# Altium schematic sheet Rows.SchDoc
size A4; DocumentNumber: 2; SheetNumber: 2; SheetTotal: 3
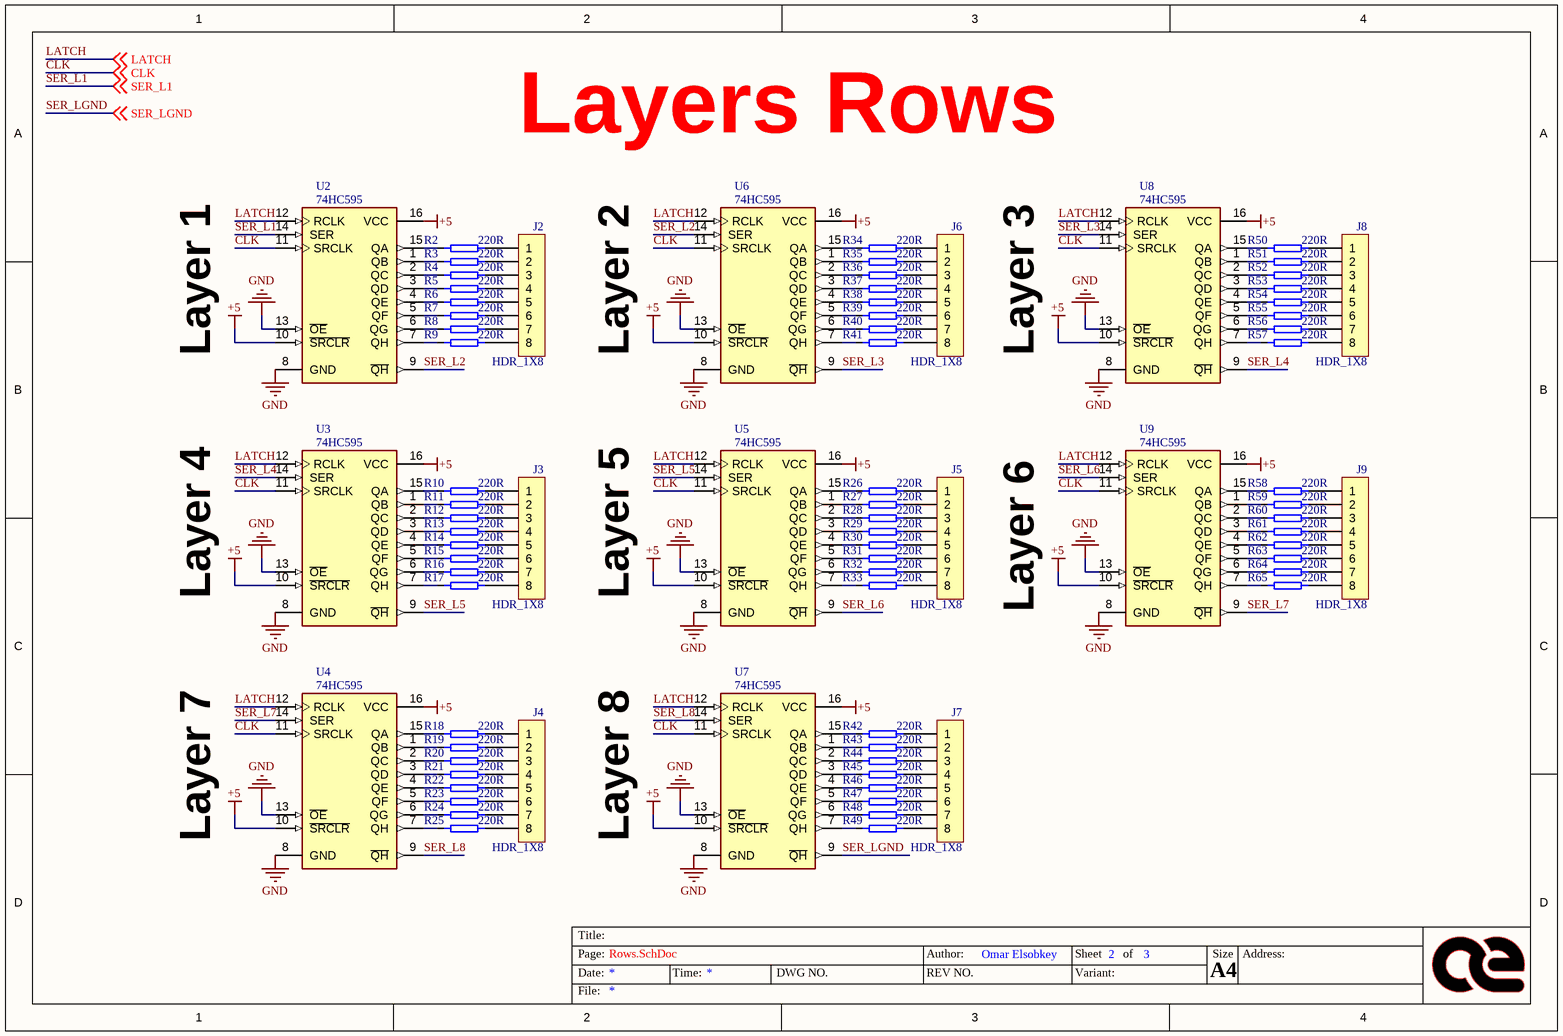
[diagram p0: Rows.SchDoc]

## Parts
J2  HDR_1X8  [HDR_1X8_2.54MM]
J3  HDR_1X8  [HDR_1X8_2.54MM]
J4  HDR_1X8  [HDR_1X8_2.54MM]
J5  HDR_1X8  [HDR_1X8_2.54MM]
J6  HDR_1X8  [HDR_1X8_2.54MM]
J7  HDR_1X8  [HDR_1X8_2.54MM]
J8  HDR_1X8  [HDR_1X8_2.54MM]
J9  HDR_1X8  [HDR_1X8_2.54MM]
R2  220R  [R_AXIAL_0.3MM]
R3  220R  [R_AXIAL_0.3MM]
R4  220R  [R_AXIAL_0.3MM]
R5  220R  [R_AXIAL_0.3MM]
R6  220R  [R_AXIAL_0.3MM]
R7  220R  [R_AXIAL_0.3MM]
R8  220R  [R_AXIAL_0.3MM]
R9  220R  [R_AXIAL_0.3MM]
R10  220R  [R_AXIAL_0.3MM]
R11  220R  [R_AXIAL_0.3MM]
R12  220R  [R_AXIAL_0.3MM]
R13  220R  [R_AXIAL_0.3MM]
R14  220R  [R_AXIAL_0.3MM]
R15  220R  [R_AXIAL_0.3MM]
R16  220R  [R_AXIAL_0.3MM]
R17  220R  [R_AXIAL_0.3MM]
R18  220R  [R_AXIAL_0.3MM]
R19  220R  [R_AXIAL_0.3MM]
R20  220R  [R_AXIAL_0.3MM]
R21  220R  [R_AXIAL_0.3MM]
R22  220R  [R_AXIAL_0.3MM]
R23  220R  [R_AXIAL_0.3MM]
R24  220R  [R_AXIAL_0.3MM]
R25  220R  [R_AXIAL_0.3MM]
R26  220R  [R_AXIAL_0.3MM]
R27  220R  [R_AXIAL_0.3MM]
R28  220R  [R_AXIAL_0.3MM]
R29  220R  [R_AXIAL_0.3MM]
R30  220R  [R_AXIAL_0.3MM]
R31  220R  [R_AXIAL_0.3MM]
R32  220R  [R_AXIAL_0.3MM]
R33  220R  [R_AXIAL_0.3MM]
R34  220R  [R_AXIAL_0.3MM]
R35  220R  [R_AXIAL_0.3MM]
R36  220R  [R_AXIAL_0.3MM]
R37  220R  [R_AXIAL_0.3MM]
R38  220R  [R_AXIAL_0.3MM]
R39  220R  [R_AXIAL_0.3MM]
R40  220R  [R_AXIAL_0.3MM]
R41  220R  [R_AXIAL_0.3MM]
R42  220R  [R_AXIAL_0.3MM]
R43  220R  [R_AXIAL_0.3MM]
R44  220R  [R_AXIAL_0.3MM]
R45  220R  [R_AXIAL_0.3MM]
R46  220R  [R_AXIAL_0.3MM]
R47  220R  [R_AXIAL_0.3MM]
R48  220R  [R_AXIAL_0.3MM]
R49  220R  [R_AXIAL_0.3MM]
R50  220R  [R_AXIAL_0.3MM]
R51  220R  [R_AXIAL_0.3MM]
R52  220R  [R_AXIAL_0.3MM]
R53  220R  [R_AXIAL_0.3MM]
R54  220R  [R_AXIAL_0.3MM]
R55  220R  [R_AXIAL_0.3MM]
R56  220R  [R_AXIAL_0.3MM]
R57  220R  [R_AXIAL_0.3MM]
R58  220R  [R_AXIAL_0.3MM]
R59  220R  [R_AXIAL_0.3MM]
R60  220R  [R_AXIAL_0.3MM]
R61  220R  [R_AXIAL_0.3MM]
R62  220R  [R_AXIAL_0.3MM]
R63  220R  [R_AXIAL_0.3MM]
R64  220R  [R_AXIAL_0.3MM]
R65  220R  [R_AXIAL_0.3MM]
U2  74HC595  [DIP16]
U3  74HC595  [DIP16]
U4  74HC595  [DIP16]
U5  74HC595  [DIP16]
U6  74HC595  [DIP16]
U7  74HC595  [DIP16]
U8  74HC595  [DIP16]
U9  74HC595  [DIP16]

## Nets
+5: U2.10(~{SRCLR}) U2.16(VCC) U3.10(~{SRCLR}) U3.16(VCC) U4.10(~{SRCLR}) U4.16(VCC) U5.10(~{SRCLR}) U5.16(VCC) U6.10(~{SRCLR}) U6.16(VCC) U7.10(~{SRCLR}) U7.16(VCC) U8.10(~{SRCLR}) U8.16(VCC) U9.10(~{SRCLR}) U9.16(VCC)
GND: U2.8(GND) U2.13(~{OE}) U3.8(GND) U3.13(~{OE}) U4.8(GND) U4.13(~{OE}) U5.8(GND) U5.13(~{OE}) U6.8(GND) U6.13(~{OE}) U7.8(GND) U7.13(~{OE}) U8.8(GND) U8.13(~{OE}) U9.8(GND) U9.13(~{OE})
CLK: U2.11(SRCLK) U3.11(SRCLK) U4.11(SRCLK) U5.11(SRCLK) U6.11(SRCLK) U7.11(SRCLK) U8.11(SRCLK) U9.11(SRCLK) ; off-sheet CLK
LATCH: U2.12(RCLK) U3.12(RCLK) U4.12(RCLK) U5.12(RCLK) U6.12(RCLK) U7.12(RCLK) U8.12(RCLK) U9.12(RCLK) ; off-sheet LATCH
SER_L1: U2.14(SER) ; off-sheet SER_L1
SER_L2: U2.9(~{QH}) U6.14(SER)
SER_L3: U6.9(~{QH}) U8.14(SER)
SER_L4: U3.14(SER) U8.9(~{QH})
SER_L5: U3.9(~{QH}) U5.14(SER)
SER_L6: U5.9(~{QH}) U9.14(SER)
SER_L7: U4.14(SER) U9.9(~{QH})
SER_L8: U4.9(~{QH}) U7.14(SER)
SER_LGND: U7.9(~{QH}) ; off-sheet SER_LGND
NetJ2_1: J2.1 R2.2
NetJ2_2: J2.2 R3.2
NetJ2_3: J2.3 R4.2
NetJ2_4: J2.4 R5.2
NetJ2_5: J2.5 R6.2
NetJ2_6: J2.6 R7.2
NetJ2_7: J2.7 R8.2
NetJ2_8: J2.8 R9.2
NetJ3_1: J3.1 R10.2
NetJ3_2: J3.2 R11.2
NetJ3_3: J3.3 R12.2
NetJ3_4: J3.4 R13.2
NetJ3_5: J3.5 R14.2
NetJ3_6: J3.6 R15.2
NetJ3_7: J3.7 R16.2
NetJ3_8: J3.8 R17.2
NetJ4_1: J4.1 R18.2
NetJ4_2: J4.2 R19.2
NetJ4_3: J4.3 R20.2
NetJ4_4: J4.4 R21.2
NetJ4_5: J4.5 R22.2
NetJ4_6: J4.6 R23.2
NetJ4_7: J4.7 R24.2
NetJ4_8: J4.8 R25.2
NetJ5_1: J5.1 R26.2
NetJ5_2: J5.2 R27.2
NetJ5_3: J5.3 R28.2
NetJ5_4: J5.4 R29.2
NetJ5_5: J5.5 R30.2
NetJ5_6: J5.6 R31.2
NetJ5_7: J5.7 R32.2
NetJ5_8: J5.8 R33.2
NetJ6_1: J6.1 R34.2
NetJ6_2: J6.2 R35.2
NetJ6_3: J6.3 R36.2
NetJ6_4: J6.4 R37.2
NetJ6_5: J6.5 R38.2
NetJ6_6: J6.6 R39.2
NetJ6_7: J6.7 R40.2
NetJ6_8: J6.8 R41.2
NetJ7_1: J7.1 R42.2
NetJ7_2: J7.2 R43.2
NetJ7_3: J7.3 R44.2
NetJ7_4: J7.4 R45.2
NetJ7_5: J7.5 R46.2
NetJ7_6: J7.6 R47.2
NetJ7_7: J7.7 R48.2
NetJ7_8: J7.8 R49.2
NetJ8_1: J8.1 R50.2
NetJ8_2: J8.2 R51.2
NetJ8_3: J8.3 R52.2
NetJ8_4: J8.4 R53.2
NetJ8_5: J8.5 R54.2
NetJ8_6: J8.6 R55.2
NetJ8_7: J8.7 R56.2
NetJ8_8: J8.8 R57.2
NetJ9_1: J9.1 R58.2
NetJ9_2: J9.2 R59.2
NetJ9_3: J9.3 R60.2
NetJ9_4: J9.4 R61.2
NetJ9_5: J9.5 R62.2
NetJ9_6: J9.6 R63.2
NetJ9_7: J9.7 R64.2
NetJ9_8: J9.8 R65.2
NetR2_1: R2.1 U2.15(QA)
NetR3_1: R3.1 U2.1(QB)
NetR4_1: R4.1 U2.2(QC)
NetR5_1: R5.1 U2.3(QD)
NetR6_1: R6.1 U2.4(QE)
NetR7_1: R7.1 U2.5(QF)
NetR8_1: R8.1 U2.6(QG)
NetR9_1: R9.1 U2.7(QH)
NetR10_1: R10.1 U3.15(QA)
NetR11_1: R11.1 U3.1(QB)
NetR12_1: R12.1 U3.2(QC)
NetR13_1: R13.1 U3.3(QD)
NetR14_1: R14.1 U3.4(QE)
NetR15_1: R15.1 U3.5(QF)
NetR16_1: R16.1 U3.6(QG)
NetR17_1: R17.1 U3.7(QH)
NetR18_1: R18.1 U4.15(QA)
NetR19_1: R19.1 U4.1(QB)
NetR20_1: R20.1 U4.2(QC)
NetR21_1: R21.1 U4.3(QD)
NetR22_1: R22.1 U4.4(QE)
NetR23_1: R23.1 U4.5(QF)
NetR24_1: R24.1 U4.6(QG)
NetR25_1: R25.1 U4.7(QH)
NetR26_1: R26.1 U5.15(QA)
NetR27_1: R27.1 U5.1(QB)
NetR28_1: R28.1 U5.2(QC)
NetR29_1: R29.1 U5.3(QD)
NetR30_1: R30.1 U5.4(QE)
NetR31_1: R31.1 U5.5(QF)
NetR32_1: R32.1 U5.6(QG)
NetR33_1: R33.1 U5.7(QH)
NetR34_1: R34.1 U6.15(QA)
NetR35_1: R35.1 U6.1(QB)
NetR36_1: R36.1 U6.2(QC)
NetR37_1: R37.1 U6.3(QD)
NetR38_1: R38.1 U6.4(QE)
NetR39_1: R39.1 U6.5(QF)
NetR40_1: R40.1 U6.6(QG)
NetR41_1: R41.1 U6.7(QH)
NetR42_1: R42.1 U7.15(QA)
NetR43_1: R43.1 U7.1(QB)
NetR44_1: R44.1 U7.2(QC)
NetR45_1: R45.1 U7.3(QD)
NetR46_1: R46.1 U7.4(QE)
NetR47_1: R47.1 U7.5(QF)
NetR48_1: R48.1 U7.6(QG)
NetR49_1: R49.1 U7.7(QH)
NetR50_1: R50.1 U8.15(QA)
NetR51_1: R51.1 U8.1(QB)
NetR52_1: R52.1 U8.2(QC)
NetR53_1: R53.1 U8.3(QD)
NetR54_1: R54.1 U8.4(QE)
NetR55_1: R55.1 U8.5(QF)
NetR56_1: R56.1 U8.6(QG)
NetR57_1: R57.1 U8.7(QH)
NetR58_1: R58.1 U9.15(QA)
NetR59_1: R59.1 U9.1(QB)
NetR60_1: R60.1 U9.2(QC)
NetR61_1: R61.1 U9.3(QD)
NetR62_1: R62.1 U9.4(QE)
NetR63_1: R63.1 U9.5(QF)
NetR64_1: R64.1 U9.6(QG)
NetR65_1: R65.1 U9.7(QH)

## Notes on the sheet
- Layers Rows
- Layer 1
- Layer 2
- Layer 3
- Layer 4
- Layer 5
- Layer 6
- Layer 7
- Layer 8
- Title:
- Page:
- Date:
- Time:
- DWG NO.
- Author:
- REV NO.
- Omar Elsobkey
- Sheet       of
- Variant:
- A4
- Size
- Address:
- File:

## Library data of the parts
J2-J9 = HDR_1X8: Male Hedader 1x8
R2-R65 = R 220
U2-U9 = 74HC595: Shift Register 74595; MP: CD74HC595E; Package: None; Price: None; Value: *; Availability: Unavailable